# Altium schematic sheet 主控原理图.SchDoc
size A3
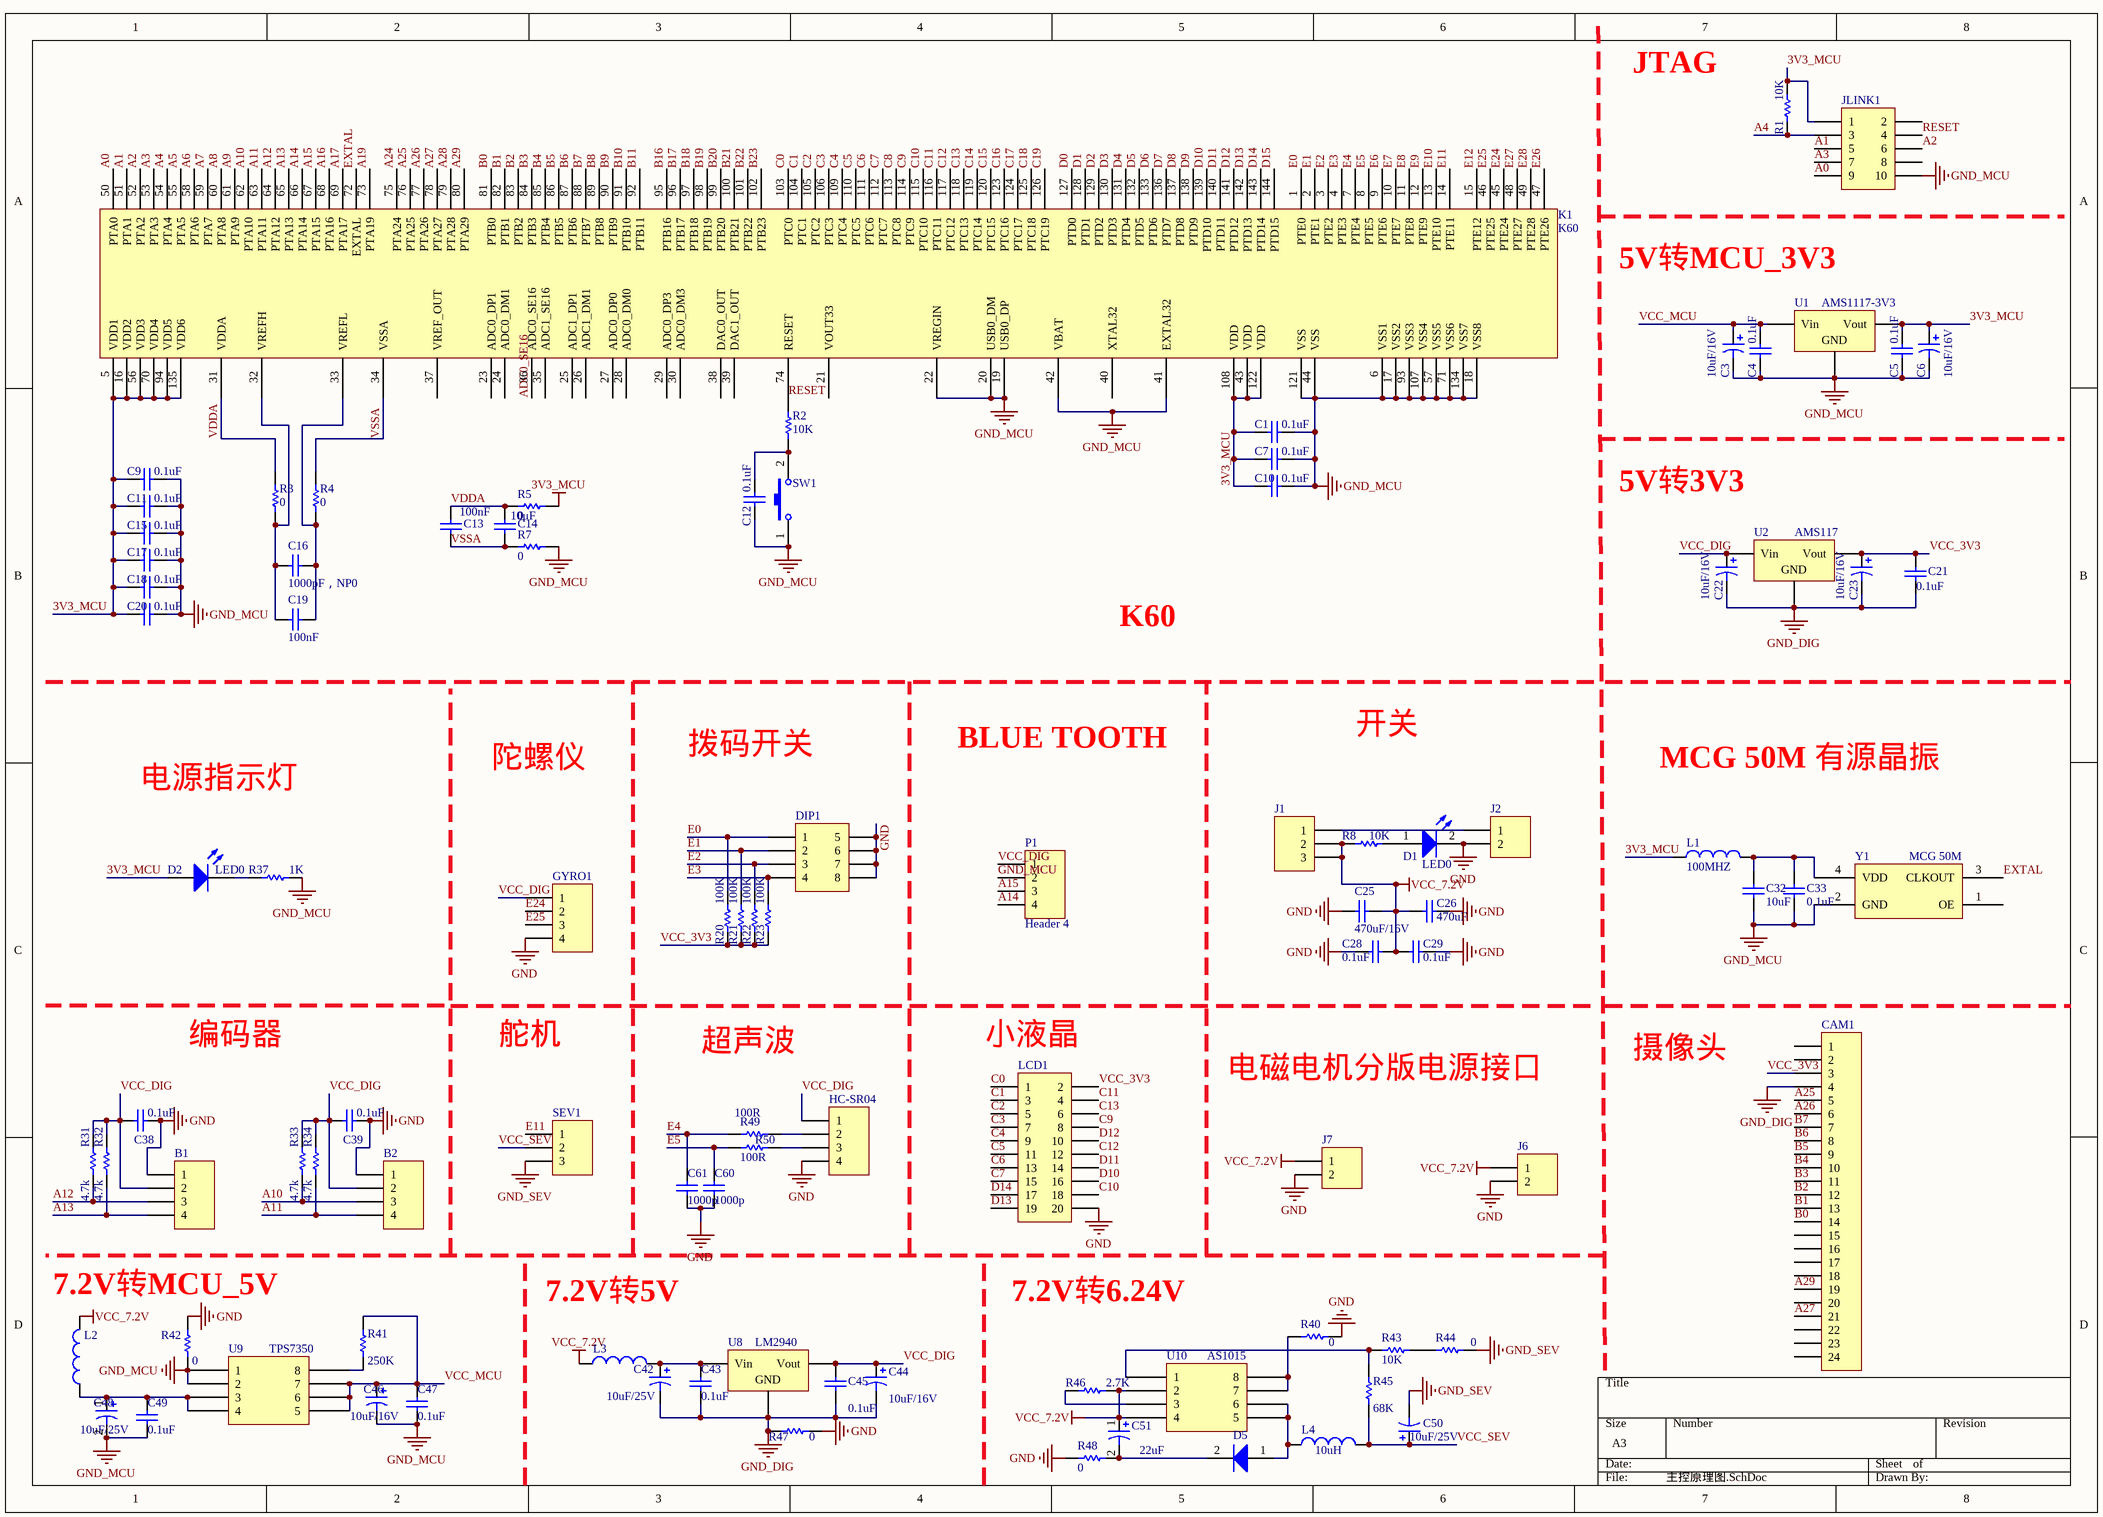
[diagram p0: 主控原理图.SchDoc]

## Parts
B1  MHDR1X4  [3PIN-2.54]  (value not drawn)
B2  MHDR1X4  [3PIN-2.54]  (value not drawn)
C1  0.1uF  [c0805]
C3  10uF/16V  [C1206]
C4  0.1uF  [c0805]
C5  0.1uF  [c0805]
C6  10uF/16V  [C1206]
C7  0.1uF  [c0805]
C9  0.1uF  [c0805]
C10  0.1uF  [c0805]
C11  0.1uF  [c0805]
C12  0.1uF  [c0805]
C13  value 100nF  [C0805]  (hidden comment: Cap Semi)
C14  10μF  [C0805]
C15  0.1uF  [c0805]
C16  value 1000pF，NP0  [C0805]  (hidden comment: Cap Semi)
C17  0.1uF  [c0805]
C18  0.1uF  [c0805]
C19  value 100nF  [C0805]  (hidden comment: Cap Semi)
C20  0.1uF  [c0805]
C21  0.1uF  [C0805]
C22  10uF/16V  [C1206]
C23  10uF/16V  [C1206]
C25  470uF/16V  [C8X8MM]
C26  value 470uF  [C8X8MM]  (hidden comment: 470uF/16V)
C28  0.1uF  [C0805]
C29  0.1uF  [C0805]
C32  10uF  [c0805]
C33  0.1uF  [c0805]
C38  0.1uF  [C0805]
C39  0.1uF  [C0805]
C42  10uF/25V  [C1206]
C43  0.1uF  [C0805]
C44  10uF/16V  [C1206]
C45  0.1uF  [C0805]
C46  10uF/16V  [C1206]
C47  0.1uF  [C0805]
C48  10uF/25V  [C1206]
C49  0.1uF  [C0805]
C50  10uF/25V  [PCBComponent_1 - duplicate6]
C51  22uF  [CAP5X5]
C60  value 1000p  [C0805]  (hidden comment: 0.1uF)
C61  value 1000p  [C0805]  (hidden comment: 0.1uF)
CAM1  Header 24  [24PIN0.5MM软排座]  (value not drawn)
D1  LED0  [d0603]
D2  LED0  [d0603]
D5  Diode 1N914  [SMA]  (value not drawn)
DIP1  Header 4X2  [PCBComponent_1 - duplicate1]  (value not drawn)
GYRO1  Header 4  [tly]  (value not drawn)
HC-SR04  Header 4  [SIP4]  (value not drawn)
J1  Header 3  [7.2]  (value not drawn)
J2  Header 2  [PCBComponent_1 - duplicate5]  (value not drawn)
J6  Header 2  [PCBComponent_1 - duplicate5]  (value not drawn)
J7  Header 2  [PCBComponent_1 - duplicate5]  (value not drawn)
JLINK1  Header 5X2  [HDR2X5]  (value not drawn)
K1  K60  [K60_QFP144]
L1  100MHZ  [l0805]
L2  (no value)  [L0805]
L3  Inductor  [L0805]  (value not drawn)
L4  10uH  [电感7x7]
LCD1  Header 10X2  [HDR2X10]  (value not drawn)
P1  Header 4  [HDR1X4]
R1  10K  [R0805]
R2  10K  [r0805]
R3  0  [R0805]
R4  0  [R0805]
R5  0  [R0805]
R7  0  [R0805]
R8  value 10K  [R0805]  (hidden comment: Res1)
R20  100K  [R0805]
R21  100K  [R0805]
R22  100K  [R0805]
R23  100K  [R0805]
R31  4.7K  [R0805]
R32  4.7K  [R0805]
R33  4.7K  [R0805]
R34  4.7K  [R0805]
R37  1K  [R0805]
R40  0  [R0805]
R41  250K  [R0805]
R42  0  [R0805]
R43  10K  [R0805]
R44  0  [R0805]
R45  68K  [R0805]
R46  2.7K  [R0805]
R47  0  [R0805]
R48  0  [R0805]
R49  value 100R  [R0805]  (hidden comment: 100K)
R50  value 100R  [R0805]  (hidden comment: 100K)
SEV1  Header 3  [SIP3]  (value not drawn)
SW1  SW-PB  [key]  (value not drawn)
U1  AMS1117-3V3  [SOT-223]
U2  AMS117  [SOT-223]
U8  LM2940  [TO263]
U9  TPS7350  [sop8]
U10  AS1015  [sop8]
Y1  MCG 50M  [MCG]

## Nets
3V3_MCU: C1.2 C5.2 C6.1 C7.2 C9.1 C10.2 C11.1 C15.1 C17.1 C18.1 C20.1 D2.1(A) JLINK1.1 K1.5(VDD1) K1.16(VDD2) K1.43(VDD) K1.56(VDD3) K1.70(VDD4) K1.94(VDD5) K1.108(VDD) K1.122(VDD) K1.135(VDD6) L1.1 R1.2 R5.1 U1.2(Vout)
GND: B1.1 B2.1 C25.2 C26.2 C28.1 C29.2 C38.2 C39.2 C60.1 C61.1 D1.2(K) DIP1.5 DIP1.6 DIP1.7 DIP1.8 GYRO1.4 HC-SR04.4 J2.2 J6.2 J7.2 LCD1.20 R40.2 R42.2 R47.2 R48.2
GND_DIG: C21.1 C22.2 C23.2 C42.2 C43.1 C44.2 C45.1 CAM1.4 R47.1 U2.1(GND) U8.2(GND)
GND_MCU: C1.1 C3.2 C4.1 C5.1 C6.2 C7.1 C9.2 C10.1 C11.2 C12.1 C15.2 C17.2 C18.2 C20.2 C32.1 C33.1 C46.2 C47.1 C48.2 C49.1 JLINK1.10 K1.6(VSS1) K1.17(VSS2) K1.18(VSS8) K1.19(USB0_DP) K1.20(USB0_DM) K1.22(VREGIN) K1.41(EXTAL32) K1.42(VBAT) K1.44(VSS) K1.57(VSS5) K1.71(VSS6) K1.93(VSS3) K1.107(VSS4) K1.121(VSS) K1.134(VSS7) P1.2 R7.1 R37.2 R42.1 SW1.1 U1.1(GND) U9.1 U9.2 Y1.2(GND)
GND_SEV: C50.2 R44.2 SEV1.3
VCC_7.2V: C25.1 C26.1 C28.2 C29.1 C51.1 J1.2 J1.3 J6.1 J7.1 L2.2 L3.1 R8.1 R46.1 U10.2 U10.4
A0: JLINK1.9 K1.50(PTA0)
A1: JLINK1.5 K1.51(PTA1)
A2: JLINK1.6 K1.52(PTA2)
A3: JLINK1.7 K1.53(PTA3)
A4: JLINK1.3 K1.54(PTA4) R1.1
A5: K1.55(PTA5)
A6: K1.58(PTA6)
A7: K1.59(PTA7)
A8: K1.60(PTA8)
A9: K1.61(PTA9)
A10: B2.3 K1.62(PTA10) R33.1
A11: B2.4 K1.63(PTA11) R34.1
A12: B1.3 K1.64(PTA12) R31.1
A13: B1.4 K1.65(PTA13) R32.1
A14: K1.66(PTA14) P1.4
A15: K1.67(PTA15) P1.3
A16: K1.68(PTA16)
A17: K1.69(PTA17)
A19: K1.73(PTA19)
A24: K1.75(PTA24)
A25: CAM1.5 K1.76(PTA25)
A26: CAM1.6 K1.77(PTA26)
A27: CAM1.21 K1.78(PTA27)
A28: K1.79(PTA28)
A29: CAM1.19 K1.80(PTA29)
ADC0_SE16: K1.36(ADC0_SE16)
B0: CAM1.14 K1.81(PTB0)
B1: CAM1.13 K1.82(PTB1)
B2: CAM1.12 K1.83(PTB2)
B3: CAM1.11 K1.84(PTB3)
B4: CAM1.10 K1.85(PTB4)
B5: CAM1.9 K1.86(PTB5)
B6: CAM1.8 K1.87(PTB6)
B7: CAM1.7 K1.88(PTB7)
B8: K1.89(PTB8)
B9: K1.90(PTB9)
B10: K1.91(PTB10)
B11: K1.92(PTB11)
B16: K1.95(PTB16)
B17: K1.96(PTB17)
B18: K1.97(PTB18)
B19: K1.98(PTB19)
B20: K1.99(PTB20)
B21: K1.100(PTB21)
B22: K1.101(PTB22)
B23: K1.102(PTB23)
C0: K1.103(PTC0) LCD1.1
C1: K1.104(PTC1) LCD1.3
C2: K1.105(PTC2) LCD1.5
C3: K1.106(PTC3) LCD1.7
C4: K1.109(PTC4) LCD1.9
C5: K1.110(PTC5) LCD1.11
C6: K1.111(PTC6) LCD1.13
C7: K1.112(PTC7) LCD1.15
C8: K1.113(PTC8)
C9: K1.114(PTC9) LCD1.8
C10: K1.115(PTC10) LCD1.18
C11: K1.116(PTC11) LCD1.4
C12: K1.117(PTC12) LCD1.12
C13: K1.118(PTC13) LCD1.6
C14: K1.119(PTC14)
C15: K1.120(PTC15)
C16: K1.123(PTC16)
C17: K1.124(PTC17)
C18: K1.125(PTC18)
C19: K1.126(PTC19)
D0: K1.127(PTD0)
D1: K1.128(PTD1)
D2: K1.129(PTD2)
D3: K1.130(PTD3)
D4: K1.131(PTD4)
D5: K1.132(PTD5)
D6: K1.133(PTD6)
D7: K1.136(PTD7)
D8: K1.137(PTD8)
D9: K1.138(PTD9)
D10: K1.139(PTD10) LCD1.16
D11: K1.140(PTD11) LCD1.14
D12: K1.141(PTD12) LCD1.10
D13: K1.142(PTD13) LCD1.19
D14: K1.143(PTD14) LCD1.17
D15: K1.144(PTD15)
E0: DIP1.1 K1.1(PTE0) R20.2
E1: DIP1.2 K1.2(PTE1) R21.2
E2: DIP1.3 K1.3(PTE2) R22.2
E3: DIP1.4 K1.4(PTE3) R23.2
E4: C61.2 K1.7(PTE4) R49.1
E5: C60.2 K1.8(PTE5) R50.1
E6: K1.9(PTE6)
E7: K1.10(PTE7)
E8: K1.11(PTE8)
E9: K1.12(PTE9)
E10: K1.13(PTE10)
E11: K1.14(PTE11) SEV1.1
E12: K1.15(PTE12)
E24: GYRO1.2 K1.45(PTE24)
E25: GYRO1.3 K1.46(PTE25)
E26: K1.47(PTE26)
E27: K1.48(PTE27)
E28: K1.49(PTE28)
EXTAL: K1.72(EXTAL) Y1.3(CLKOUT)
RESET: JLINK1.4 K1.74(RESET) R2.2
VCC_3V3: C21.2 C23.1 CAM1.3 LCD1.2 R20.1 R21.1 R22.1 R23.1 U2.2(Vout)
VCC_DIG: B1.2 B2.2 C22.1 C38.1 C39.1 C44.1 C45.2 GYRO1.1 HC-SR04.1 P1.1 R31.2 R32.2 R33.2 R34.2 U2.3(Vin) U8.3(Vout)
VCC_MCU: C3.1 C4.2 C46.1 C47.2 R41.2 U1.3(Vin) U9.5 U9.6 U9.7
VCC_SEV: C50.1 L4.2 R45.1 SEV1.2
VDDA: C13.2 C14.2 K1.31(VDDA) R3.2 R5.2
VSSA: C13.1 C14.1 K1.34(VSSA) R4.2 R7.2
NetC12_2: C12.2 R2.1 SW1.2
NetC16_1: C16.1 C19.1 K1.33(VREFL) R4.1
NetC16_2: C16.2 C19.2 K1.32(VREFH) R3.1
NetC32_2: C32.2 C33.2 L1.2 Y1.4(VDD)
NetC42_1: C42.1 C43.2 L3.2 U8.1(Vin)
NetC48_1: C48.1 C49.2 L2.1 U9.3 U9.4
NetC51_2: C51.2 D5.2 R48.1
NetD1_1: D1.1(A) R8.2
NetD2_2: D2.2(K) R37.1
NetD5_1: D5.1 L4.1 U10.5 U10.6
NetHC-SR04_2: HC-SR04.2 R49.2
NetHC-SR04_3: HC-SR04.3 R50.2
NetJ1_1: J1.1 J2.1
NetR40_1: R40.1 U10.7 U10.8
NetR41_1: R41.1 U9.8
NetR43_1: R43.1 R44.1
NetR43_2: R43.2 R45.2 U10.1
NetR46_2: R46.2 U10.3

Not connected (* = marked no-connect by the designer): CAM1 1 2 15 16 17 18 20 22 23 24; JLINK1 2 8; K1 21(VOUT33) 23(ADC0_DP1) 24(ADC0_DM1) 25(ADC1_DP1) 26(ADC1_DM1) 27(ADC0_DP0) 28(ADC0_DM0) 29(ADC0_DP3) 30(ADC0_DM3) 35(ADC1_SE16) 37(VREF_OUT) 38(DAC0_OUT) 39(DAC1_OUT) 40(XTAL32); Y1 1(OE)

## Notes on the sheet
- JTAG
- 5V转MCU_3V3
- 5V转3V3
- K60
- 电源指示灯
- 陀螺仪
- 拨码开关
- BLUE TOOTH
- 开关
- MCG 50M 有源晶振
- 编码器
- 舵机
- 超声波
- (near LCD1) 小液晶
- 摄像头
- 电磁电机分版电源接口
- 7.2V转MCU_5V
- 7.2V转5V
- 7.2V转6.24V

## Library data of the parts
B1 B2 = MHDR1X4: Header, 4-Pin; LatestRevisionDate: 17-Jul-2002; LatestRevisionNote: Re-released for DXP Platform.; Publisher: Altium Limited
C1 C7 C10 C21 C25 C26 C28 C29 C32 C33 C38 C39 C43 C45 C47 C49 C60 C61 = Cap: Capacitor; Published: 8-Jun-2000; LatestRevisionDate: 17-Jul-2002; LatestRevisionNote: Re-released for DXP Platform.; PackageReference: RAD-0.3; Publisher: Altium Limited; PackageDescription: Radial Cap, Thru-Hole; 2 Leads; 0.3 in Pin Spacing
  C1 C7 C10 C21 C28 C29 C33 C38 C39 C43 C45 C47 C49: Value: 0.1uF
  C25: Value: 470uF/16V
  C32: Value: 10uF
C3 C6 C22 C23 C42 C44 C46 C48 C50 C51 = Cap Pol1: Polarized Capacitor (Radial); Published: 8-Jun-2000; LatestRevisionDate: 17-Jul-2002; LatestRevisionNote: Re-released for DXP Platform.; PackageReference: RB7.6-15; Publisher: Altium Limited; PackageDescription: Polarized Capacitor (Radial); 2 Leads
  C3 C6 C22 C23 C44 C46: Value: 10uF/16V
  C42 C48 C50: Value: 10uF/25V
  C51: Value: 22uF
C4 C5 C9 C11 C12 C15 C17 C18 C20 = Cap: Capacitor; Value: 100pF; Published: 8-Jun-2000; LatestRevisionDate: 17-Jul-2002; LatestRevisionNote: Re-released for DXP Platform.; PackageReference: RAD-0.3; Publisher: Altium Limited; PackageDescription: Radial Cap, Thru-Hole; 2 Leads; 0.3 in Pin Spacing
C13 C14 C16 C19 = Cap Semi: Capacitor (Semiconductor SIM Model); Published: 8-Jun-2000; LatestRevisionDate: 29-May-2009; LatestRevisionNote: IPC-7351 Footprint Added.; PackageReference: C1206; Publisher: Altium Limited; PackageDescription: Chip Capacitor
  C14: Value: 10μF
CAM1 = Header 24: Header, 24-Pin; LatestRevisionDate: 17-Jul-2002; LatestRevisionNote: Re-released for DXP Platform.; Publisher: Altium Limited
D1 D2 = LED0: Typical INFRARED GaAs LED; Published: 8-Jun-2000; LatestRevisionDate: 08-Jul-2005; LatestRevisionNote: Mech Layer 1 removed.; PackageReference: LED-0; Publisher: Altium Limited; PackageDescription: LED; 2 Leads
D5 = Diode 1N914: High Conductance Fast Diode; Published: 8-Jun-2000; LatestRevisionDate: 17-Jul-2002; LatestRevisionNote: Re-released for DXP Platform.; DatasheetVersion: 1997; PackageReference: DO-35; Publisher: Altium Limited; PackageDescription: Diode, Axial; Body 3.8 x 1.9 mm (LxDia. max), Lead Dia. 0.53 mm (max); Code_JEDEC: DO-204-AH; ComponentLink1Description: Manufacturer Link; ComponentLink1URL: http://www.fairchildsemi.com/; ComponentLink2Description: Datasheet; ComponentLink2URL: http://www.fairchildsemi.com/ds/1N%2F1N4448.pdf
DIP1 = Header 4X2: Header, 4-Pin, Dual row; LatestRevisionDate: 17-Jul-2002; LatestRevisionNote: Re-released for DXP Platform.; Publisher: Altium Limited
GYRO1 HC-SR04 P1 = Header 4: Header, 4-Pin; LatestRevisionDate: 17-Jul-2002; LatestRevisionNote: Re-released for DXP Platform.; Publisher: Altium Limited
J1 SEV1 = Header 3: Header, 3-Pin; LatestRevisionDate: 17-Jul-2002; LatestRevisionNote: Re-released for DXP Platform.; Publisher: Altium Limited
J2 J6 J7 = Header 2: Header, 2-Pin; LatestRevisionDate: 17-Jul-2002; LatestRevisionNote: Re-released for DXP Platform.; Publisher: Altium Limited
JLINK1 = Header 5X2: Header, 5-Pin, Dual row; LatestRevisionDate: 17-Jul-2002; LatestRevisionNote: Re-released for DXP Platform.; Publisher: Altium Limited
K1 U9 U10 = Component_1
L1 L4 = Inductor: Code_IEC: 1005; Published: 8-Jun-2000; LatestRevisionDate: 29-May-2009; LatestRevisionNote: IPC-7351 Footprint Added.; PackageReference: 0402-A; Publisher: Altium Limited; PackageDescription: Chip Inductor; Code_JEITA: 0402
  L1: Value: 100MHZ
  L4: Value: 10uH
L2 L3 = Inductor: Code_IEC: 1005; Value: 10mH; Published: 8-Jun-2000; LatestRevisionDate: 29-May-2009; LatestRevisionNote: IPC-7351 Footprint Added.; PackageReference: 0402-A; Publisher: Altium Limited; PackageDescription: Chip Inductor; Code_JEITA: 0402
LCD1 = Header 10X2: Header, 10-Pin, Dual row; LatestRevisionDate: 17-Jul-2002; LatestRevisionNote: Re-released for DXP Platform.; Publisher: Altium Limited
R1-R5 R7 R8 R20-R23 R31-R34 R37 R40-R50 = Res1: Resistor; Published: 8-Jun-2000; LatestRevisionDate: 17-Jul-2002; LatestRevisionNote: Re-released for DXP Platform.; PackageReference: AXIAL-0.3; Publisher: Altium Limited; PackageDescription: Axial Device, Thru-Hole; 2 Leads; 0.3 in Pin Spacing
  R1 R2 R43: Value: 10K
  R3-R5 R7 R40 R42 R44 R47 R48: Value: 0
  R20-R23: Value: 100K
  R31-R34: Value: 4.7k
  R37: Value: 1K
  R41: Value: 250K
  R45: Value: 68K
  R46: Value: 2.7K
SW1 = SW-PB: Switch; Published: 24-Mar-1999; LatestRevisionDate: 17-Jul-2002; LatestRevisionNote: Re-released for DXP Platform.; PackageReference: SPST-2; Publisher: Altium Limited; PackageDescription: Switch; 2 Leads
U1 U2 U8 = Volt Reg: Voltage Regulator; Published: 24-Mar-1999; LatestRevisionDate: 29-May-2009; LatestRevisionNote: IPC-7351 Footprint Added.; PackageReference: D2PAK; Publisher: Altium Limited; PackageDescription: 3-Pin Transistor Outline Package 2.54 mm Pitch, 15.1 mm Lead Span
Y1 = Component_2